# Altium project Arduino幻彩灯带.PrjPcb
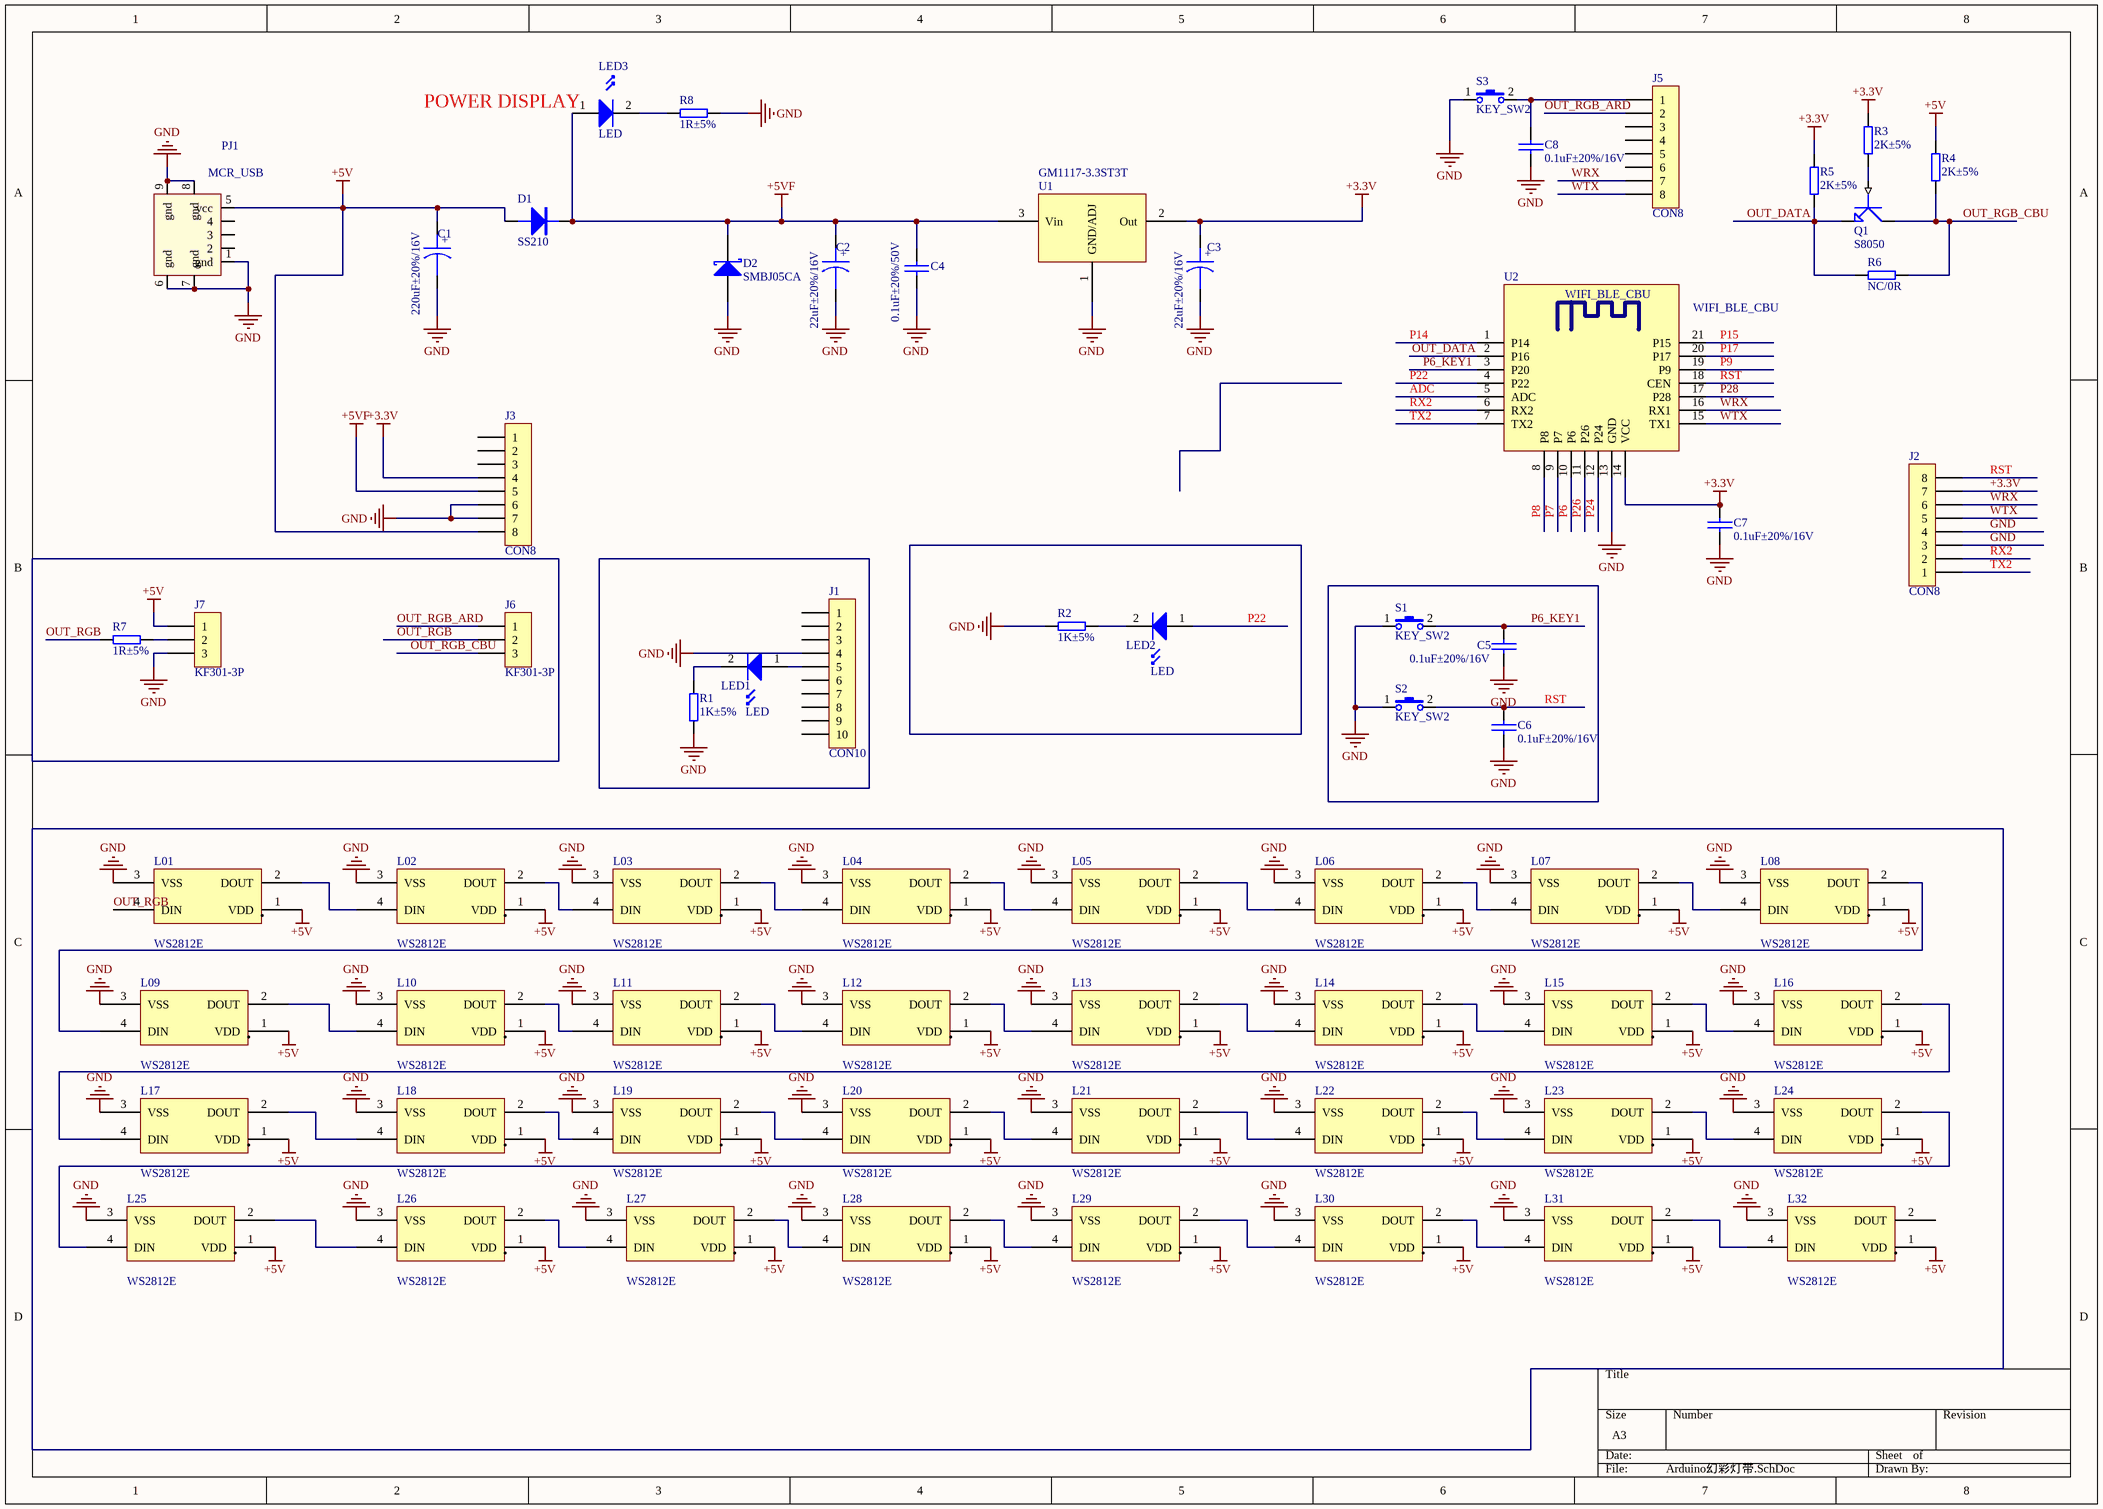
[diagram p0: Arduino幻彩灯带.SchDoc]
1 sheet, 66 parts. Net scope: global (net labels, ports and power ports of the same name join across sheets).
Board file: 幻彩灯带.PcbDoc

## Sheet Arduino幻彩灯带.SchDoc
size A3

### Parts
C1  220uF±20%/16V  [钽电容B3528]
C2  22uF±20%/16V  [钽电容B3528]
C3  22uF±20%/16V  [钽电容B3528]
C4  0.1uF±20%/50V  [C0603]
C5  0.1uF±20%/16V  [C0603]
C6  0.1uF±20%/16V  [C0603]
C7  0.1uF±20%/16V  [C0603]
C8  0.1uF±20%/16V  [C0603]
D1  SS210  [SMA(DO-214AC)]
D2  SMBJ05CA  [SMB(DO-214AA)]
J1  CON10  [HDR1X10Z]
J2  CON8  [HDR1X8Z]
J3  CON8  [HDR1X8Z]
J5  CON8  [HDR1X8Z]
J6  KF301-3P  [SIP3 - 2.54]
J7  KF301-3P  [SIP3 - 2.54]
L01  WS2812E  [WS2812E]
L02  WS2812E  [WS2812E]
L03  WS2812E  [WS2812E]
L04  WS2812E  [WS2812E]
L05  WS2812E  [WS2812E]
L06  WS2812E  [WS2812E]
L07  WS2812E  [WS2812E]
L08  WS2812E  [WS2812E]
L09  WS2812E  [WS2812E]
L10  WS2812E  [WS2812E]
L11  WS2812E  [WS2812E]
L12  WS2812E  [WS2812E]
L13  WS2812E  [WS2812E]
L14  WS2812E  [WS2812E]
L15  WS2812E  [WS2812E]
L16  WS2812E  [WS2812E]
L17  WS2812E  [WS2812E]
L18  WS2812E  [WS2812E]
L19  WS2812E  [WS2812E]
L20  WS2812E  [WS2812E]
L21  WS2812E  [WS2812E]
L22  WS2812E  [WS2812E]
L23  WS2812E  [WS2812E]
L24  WS2812E  [WS2812E]
L25  WS2812E  [WS2812E]
L26  WS2812E  [WS2812E]
L27  WS2812E  [WS2812E]
L28  WS2812E  [WS2812E]
L29  WS2812E  [WS2812E]
L30  WS2812E  [WS2812E]
L31  WS2812E  [WS2812E]
L32  WS2812E  [WS2812E]
LED1  LED  [LED0805_1]
LED2  LED  [LED0805_1]
LED3  LED  [LED0805_1]
PJ1  MCR_USB  [MICRO_USB-NEW-16.12.12]
Q1  S8050  [SOT-23-NPN]
R1  1K±5%  [R0603]
R2  1K±5%  [R0603]
R3  2K±5%  [R0603]
R4  2K±5%  [R0603]
R5  2K±5%  [R0603]
R6  NC/0R  [R0603]
R7  1R±5%  [R0603]
R8  1R±5%  [R0603]
S1  KEY_SW2  [KEY4-SMD]
S2  KEY_SW2  [KEY4-SMD]
S3  KEY_SW2  [KEY4-SMD]
U1  GM1117-3.3ST3T  [SOT-223]
U2  WIFI_BLE_CBU  [WIFI_BLE_CBU]

### Nets
+3.3V: C3.1 C7.2 J2.7 J3.4 R3.1 R5.1 U1.2(Out) U2.14(VCC)
+5V: C1.1 D1.1 J3.8 J7.1 L01.1(VDD) L02.1(VDD) L03.1(VDD) L04.1(VDD) L05.1(VDD) L06.1(VDD) L07.1(VDD) L08.1(VDD) L09.1(VDD) L10.1(VDD) L11.1(VDD) L12.1(VDD) L13.1(VDD) L14.1(VDD) L15.1(VDD) L16.1(VDD) L17.1(VDD) L18.1(VDD) L19.1(VDD) L20.1(VDD) L21.1(VDD) L22.1(VDD) L23.1(VDD) L24.1(VDD) L25.1(VDD) L26.1(VDD) L27.1(VDD) L28.1(VDD) L29.1(VDD) L30.1(VDD) L31.1(VDD) L32.1(VDD) PJ1.5(vcc) R4.1
+5VF: C2.1 C4.1 D1.2 D2.2(K) J3.5 LED3.1 U1.3(Vin)
GND: C1.2 C2.2 C3.2 C4.2 C5.1 C6.2 C7.1 C8.1 D2.1(A) J1.4 J2.3 J2.4 J3.6 J3.7 J7.3 L01.3(VSS) L02.3(VSS) L03.3(VSS) L04.3(VSS) L05.3(VSS) L06.3(VSS) L07.3(VSS) L08.3(VSS) L09.3(VSS) L10.3(VSS) L11.3(VSS) L12.3(VSS) L13.3(VSS) L14.3(VSS) L15.3(VSS) L16.3(VSS) L17.3(VSS) L18.3(VSS) L19.3(VSS) L20.3(VSS) L21.3(VSS) L22.3(VSS) L23.3(VSS) L24.3(VSS) L25.3(VSS) L26.3(VSS) L27.3(VSS) L28.3(VSS) L29.3(VSS) L30.3(VSS) L31.3(VSS) L32.3(VSS) PJ1.1(gnd) PJ1.6(gnd) PJ1.7(gnd) PJ1.8(gnd) PJ1.9(gnd) R1.1 R2.2 R8.2 S1.1 S2.1 S3.1 U1.1(GND/ADJ) U2.13(GND)
ADC: U2.5(ADC)
OUT_DATA: Q1.1(E) R5.2 R6.1 U2.2(P16)
OUT_RGB: J6.2 L01.4(DIN) R7.1
OUT_RGB_ARD: J5.2 J6.1
OUT_RGB_CBU: J6.3 Q1.3(C) R4.2 R6.2
P6: U2.10(P6)
P6_KEY1: C5.2 S1.2 U2.3(P20)
P7: U2.9(P7)
P8: U2.8(P8)
P9: U2.19(P9)
P14: U2.1(P14)
P15: U2.21(P15)
P17: U2.20(P17)
P22: LED2.1 U2.4(P22)
P24: U2.12(P24)
P26: U2.11(P26)
P28: U2.17(P28)
RST: C6.1 J2.8 S2.2 U2.18(CEN)
RX2: J2.2 U2.6(RX2)
TX2: J2.1 U2.7(TX2)
WRX: J2.6 J5.7 U2.16(RX1)
WTX: J2.5 J5.8 U2.15(TX1)
NetC8_2: C8.2 J5.1 S3.2
NetJ1_5: J1.5 LED1.1
NetJ7_2: J7.2 R7.2
NetL01_2: L01.2(DOUT) L02.4(DIN)
NetL02_2: L02.2(DOUT) L03.4(DIN)
NetL03_2: L03.2(DOUT) L04.4(DIN)
NetL04_2: L04.2(DOUT) L05.4(DIN)
NetL05_2: L05.2(DOUT) L06.4(DIN)
NetL06_2: L06.2(DOUT) L07.4(DIN)
NetL07_2: L07.2(DOUT) L08.4(DIN)
NetL08_2: L08.2(DOUT) L09.4(DIN)
NetL09_2: L09.2(DOUT) L10.4(DIN)
NetL10_2: L10.2(DOUT) L11.4(DIN)
NetL11_2: L11.2(DOUT) L12.4(DIN)
NetL12_2: L12.2(DOUT) L13.4(DIN)
NetL13_2: L13.2(DOUT) L14.4(DIN)
NetL14_2: L14.2(DOUT) L15.4(DIN)
NetL15_2: L15.2(DOUT) L16.4(DIN)
NetL16_2: L16.2(DOUT) L17.4(DIN)
NetL17_2: L17.2(DOUT) L18.4(DIN)
NetL18_2: L18.2(DOUT) L19.4(DIN)
NetL19_2: L19.2(DOUT) L20.4(DIN)
NetL20_2: L20.2(DOUT) L21.4(DIN)
NetL21_2: L21.2(DOUT) L22.4(DIN)
NetL22_2: L22.2(DOUT) L23.4(DIN)
NetL23_2: L23.2(DOUT) L24.4(DIN)
NetL24_2: L24.2(DOUT) L25.4(DIN)
NetL25_2: L25.2(DOUT) L26.4(DIN)
NetL26_2: L26.2(DOUT) L27.4(DIN)
NetL27_2: L27.2(DOUT) L28.4(DIN)
NetL28_2: L28.2(DOUT) L29.4(DIN)
NetL29_2: L29.2(DOUT) L30.4(DIN)
NetL30_2: L30.2(DOUT) L31.4(DIN)
NetL31_2: L31.2(DOUT) L32.4(DIN)
NetLED1_2: LED1.2 R1.2
NetLED2_2: LED2.2 R2.1
NetLED3_2: LED3.2 R8.1
NetQ1_2: Q1.2(B) R3.2

Not connected (* = marked no-connect by the designer): J1 1 2 3 6 7 8 9 10; J3 1 2 3; J5 3 4 5 6; L32 2(DOUT); PJ1 2 3 4

### Notes on the sheet
- (near LED3) POWER DISPLAY
- (in symbol CAPACITOR POL) +
- (in symbol WS2812E) .

### Library data of the parts
C1-C3 = CAPACITOR POL: Capacitor
C4-C8 = CAP: Capacitor
D1 = Diode1: Diode
D2 = D Schottky: Schottky Diode; MFR: Toshiba
J1 = CON10: Connector
J2 J3 J5 = CON8: Connector
J6 J7 = CON3: Connector
Q1 = NPN: NPN Transistor
R1-R8 = RES5
U1 = GM1117
U2 = WIFI_BLE_CBU: Module
LED1-LED3 = LED: Published: *; LatestRevisionDate: *; LatestRevisionNote: *; DatasheetDocument: *; PackageDocument: *; PackageReference: *; Publisher: *; ComponentLink1Description: *; ComponentLink1URL: *; Code_JEDEC: *
PJ1 = MCR_USB: Published: *; Revision 1: *; Revision 2: *; Datasheet: *; Publisher: *